# Altium schematic sheet ZHSD-USB-OTG.SchDoc
size A3; DocumentNumber: 10; SheetNumber: 10; SheetTotal: 17; Size: A3
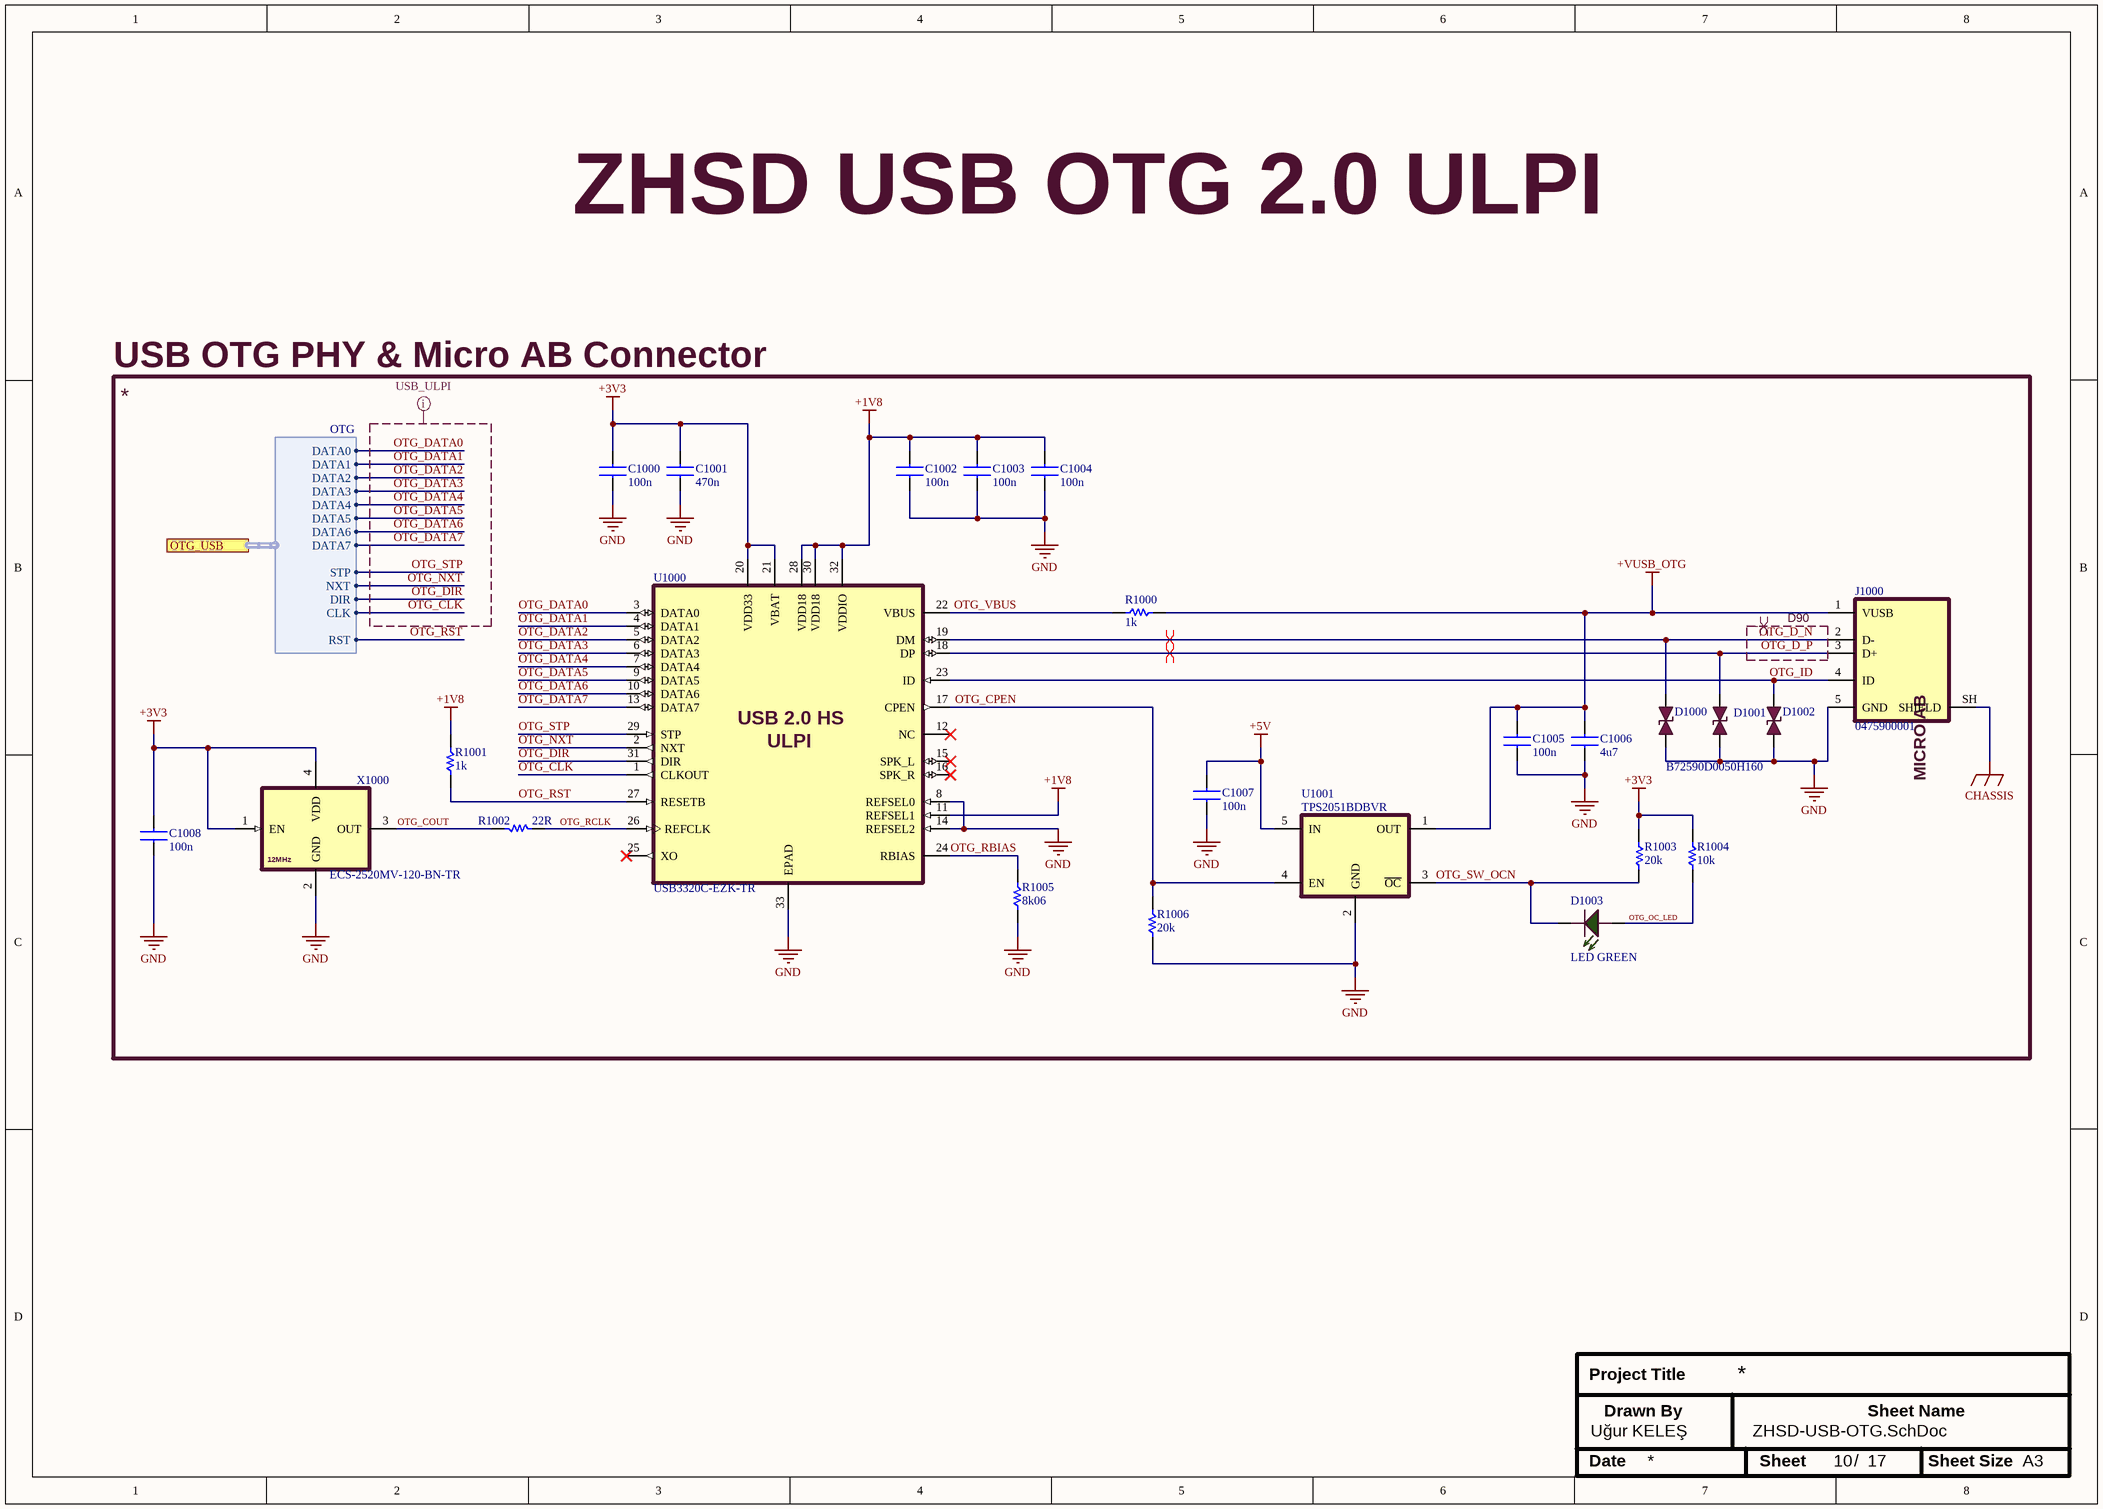
[diagram p0: ZHSD-USB-OTG.SchDoc]

## Parts
C1000  100n  [0603CAPC1608X09N]
C1001  470n  [0402CAPC1005X06N]
C1002  100n  [0603CAPC1608X09N]
C1003  100n  [0603CAPC1608X09N]
C1004  100n  [0603CAPC1608X09N]
C1005  100n  [0603CAPC1608X09N]
C1006  4u7  [0603CAPC1608X09N]
C1007  100n  [0603CAPC1608X09N]
C1008  100n  [0603CAPC1608X09N]
D1000  B72590D0050H160  [0402DIOC1005X06N]  (value not drawn)
D1001  B72590D0050H160  [0402DIOC1005X06N]  (value not drawn)
D1002  B72590D0050H160  [0402DIOC1005X06N]
D1003  LED GREEN  [0603_LED_1608N]
J1000  0475900001  [USB2.0 MICRO AB SMD]
R1000  1k  [0603RESC1608X05N]
R1001  1k  [0603RESC1608X05N]
R1002  22R  [0603RESC1608X05N]
R1003  20k  [0402RESC1005X04N]
R1004  10k  [0603RESC1608X05N]
R1005  8k06  [0402RESC1005X04N]
R1006  20k  [0402RESC1005X04N]
U1000  USB3320C-EZK-TR  [QFN50P500X500X100_HS-33N]
U1001  TPS2051BDBVR  [SOT95P280X125-5N]
X1000  ECS-2520MV-120-BN-TR  [XTAL_2520]

## Ports
OTG_USB (harness OTG, see ZHSD-Block[4000,3700], ZHSD-ZYNQ-MIO[8100,8300])

## Harnesses
OTG: DATA0, DATA1, DATA2, DATA3, DATA4, DATA5, DATA6, DATA7, STP, NXT, DIR, CLK, RST

## Nets
+1V8: C1002.2 C1003.2 C1004.2 R1001.2 U1000.11(REFSEL1) U1000.28(VDD18) U1000.30(VDD18) U1000.32(VDDIO)
+3V3: C1000.2 C1001.2 C1008.2 R1003.1 R1004.2 U1000.20(VDD33) U1000.21(VBAT) X1000.1(EN) X1000.4(VDD)
+5V: C1007.2 U1001.5(IN)
+VUSB_OTG: C1005.2 C1006.2 J1000.1(VUSB) R1000.2 U1001.1(OUT)
CHASSIS: J1000.SH(SHIELD)
GND: C1000.1 C1001.1 C1002.1 C1003.1 C1004.1 C1005.1 C1006.1 C1007.1 C1008.1 D1000.1 D1001.1 D1002.1 J1000.5(GND) R1005.1 R1006.1 U1000.8(REFSEL0) U1000.14(REFSEL2) U1000.33(EPAD) U1001.2(GND) X1000.2(GND)
OTG_CLK: U1000.1(CLKOUT) ; port OTG_USB.CLK
OTG_COUT: R1002.2 X1000.3(OUT)
OTG_CPEN: R1006.2 U1000.17(CPEN) U1001.4(EN)
OTG_D_N: D1000.2 J1000.2(D-) U1000.19(DM)
OTG_D_P: D1001.2 J1000.3(D+) U1000.18(DP)
OTG_DATA0: U1000.3(DATA0) ; port OTG_USB.DATA0
OTG_DATA1: U1000.4(DATA1) ; port OTG_USB.DATA1
OTG_DATA2: U1000.5(DATA2) ; port OTG_USB.DATA2
OTG_DATA3: U1000.6(DATA3) ; port OTG_USB.DATA3
OTG_DATA4: U1000.7(DATA4) ; port OTG_USB.DATA4
OTG_DATA5: U1000.9(DATA5) ; port OTG_USB.DATA5
OTG_DATA6: U1000.10(DATA6) ; port OTG_USB.DATA6
OTG_DATA7: U1000.13(DATA7) ; port OTG_USB.DATA7
OTG_DIR: U1000.31(DIR) ; port OTG_USB.DIR
OTG_ID: D1002.2 J1000.4(ID) U1000.23(ID)
OTG_NXT: U1000.2(NXT) ; port OTG_USB.NXT
OTG_OC_LED: D1003.1(A) R1004.1
OTG_RBIAS: R1005.2 U1000.24(RBIAS)
OTG_RCLK: R1002.1 U1000.26(REFCLK)
OTG_RST: R1001.1 U1000.27(RESETB) ; port OTG_USB.RST
OTG_STP: U1000.29(STP) ; port OTG_USB.STP
OTG_SW_OCN: D1003.2(C) R1003.2 U1001.3(~{OC})
OTG_VBUS: R1000.1 U1000.22(VBUS)

Not connected (* = marked no-connect by the designer): U1000 12(NC)* 15(SPK_L)* 16(SPK_R)* 25(XO)*

## Layout directives
differential pair: OTG_D_N, OTG_D_P
differential pair; differential pair class USB; rule Differential Pairs Routing [Pref Gap = 6.299mil    Min Gap  = 5mil    Max Gap  = 7.874milPref Width = 3.937mil    Min Width  = 3.937mil    Max Width  = 4.768mil]; Impedance: D90: OTG_D_N, OTG_D_P
net class USB_ULPI; rule Matched Net Lengths [Delay Tolerance = 10ps]: OTG_CLK, OTG_DATA0, OTG_DATA1, OTG_DATA2, OTG_DATA3, OTG_DATA4, OTG_DATA5, OTG_DATA6, OTG_DATA7, OTG_DIR, OTG_NXT, OTG_STP

## Notes on the sheet
- ZHSD USB OTG 2.0 ULPI
- USB OTG PHY & Micro AB Connector
- *
- Project Title
- Uğur KELEŞ
- Drawn By
- Sheet Name
- Date
- Sheet
- /
- Sheet Size
- A3
- (in symbol ECS-2520MV-120-BN-TR) 12MHz
- (in symbol USB3320C-EZK-TR) USB 2.0 HS; ULPI
- (in symbol USB-MICRO-AB) MICRO AB

## Library data of the parts
C1000 C1002-C1005 C1007 = GRM155R71C104KA88J: CAP CER 0.1UF 16V X7R 0402 (1005) ±10%; Manufacturer: Murata Electronics; Value: 0.1 µF; ComponentLink1Description: Datasheet; ComponentLink1URL: https://search.murata.co.jp/Ceramy/image/img/A01X/G101/ENG/GRM155R71C104KA88-01.pdf; MPN: GRM155R71C104KA88J; Package: 0402; Tolerance: ±10%; Voltage: 16V
C1001 = GRM155R60J474KE19D: CAP CER 0.47UF 6.3V X5R 0402(1005) ±10%; Manufacturer: Murata Electronics; Value: 0.47 µF; ComponentLink1Description: Datasheet; ComponentLink1URL: https://search.murata.co.jp/Ceramy/image/img/A01X/G101/ENG/GRM21BR71A475KE51-01.pdf; MPN: GRM155R60J474KE19D; Package: 0402; Tolerance: ±10%; Voltage: 6.3V
C1006 = CL10A475KP8NNNC: CAP CER 4.7UF 10V X5R 0603 (1608) ±10%; Manufacturer: Samsung Electro-Mechanics; Value: 4.7 µF; ComponentLink1Description: Datasheet; ComponentLink1URL: https://mm.digikey.com/Volume0/opasdata/d220001/medias/docus/609/CL10A475KP8NNNC_Spec.pdf; MPN: CL10A475KP8NNNC; Package: 0603; Tolerance: ±10%; Voltage: 10V
C1008 = C0603C104K5RACTU: CAP CER 0.1UF 50V X7R 0603 (1608) ±10%; Manufacturer: KEMET; Value: 0.1 µF; ComponentLink1Description: Datasheet; ComponentLink1URL: https://yageogroup.com/content/datasheet/asset/file/KEM_C1002_X7R_SMD; MPN: C0603C104K5RACTU; Package: 0603; Tolerance: ±10%; Voltage: 50V
D1000-D1002 = B72590D0050H160: Varistor 1 Circuit Surface Mount, MLCV 0402 (1005 Metric); Manufacturer: EPCOS - TDK Electronics; ComponentLink1Description: Datasheet; ComponentLink1URL: https://www.tdk-electronics.tdk.com/inf/75/ds/High_speed_series.pdf?ref_disty=digikey; MPN: B72590D0050H160; Package: 0402
D1003 = LTST-C191TGKT: LED GREEN CLEAR CHIP SMD; Manufacturer: Lite-On Inc.; ComponentLink1Description: Datasheet; ComponentLink1URL: https://optoelectronics.liteon.com/upload/download/DS22-2000-300/LTST-C191TGKT.PDF; MPN: LTST-C191TGKT; Package: 0603
J1000 = USB-MICRO-AB: CONN RCPT MICRO USB AB 5P SMD RA; Manufacturer: Molex; ComponentLink1Description: Datasheet; ComponentLink1URL: https://www.molex.com/content/dam/molex/molex-dot-com/products/automated/en-us/salesdrawingpdf/475/47590/475900001_sd.pdf?inline; MPN: 0475900001
R1000 R1001 = RC0603FR-071KL: RES 1K OHM 1% 1/10W 0603 (1608); Manufacturer: YAGEO; Value: 1 kOhms; Voltage: 75V; ComponentLink1Description: Datasheet; ComponentLink1URL: https://yageogroup.com/content/datasheet/asset/file/PYU-RC_GROUP_51_ROHS_L; MPN: RC0603FR-071KL; Tolerance: ±1%; Package: 0603
R1002 = RC0603FR-0722RL: RES 22 OHM 1% 1/10W 0603 (1608); Manufacturer: YAGEO; Value: 22 Ohms; Voltage: 75V; ComponentLink1Description: Datasheet; ComponentLink1URL: https://yageogroup.com/content/datasheet/asset/file/PYU-RC_GROUP_51_ROHS_L; MPN: RC0603FR-0722RL; Tolerance: ±1%; Package: 0603
R1003 R1006 = RC0402FR-0720KL: RES 20K OHM 1% 1/16W 0402 (1005); Manufacturer: YAGEO; Value: 20 kOhms; Voltage: 50V; ComponentLink1Description: Datasheet; ComponentLink1URL: https://yageogroup.com/content/datasheet/asset/file/PYU-RT_1-TO-0-01_ROHS_L; MPN: RC0402FR-0720KL; Tolerance: ±1%; Package: 0402
R1004 = RC0603FR-0710KL: RES 10K OHM 1% 1/10W 0603(1608); Manufacturer: YAGEO; Value: 10 kOhms; Voltage: 75V; ComponentLink1Description: Datasheet; ComponentLink1URL: https://yageogroup.com/content/datasheet/asset/file/PYU-RC_GROUP_51_ROHS_L; MPN: RC0603FR-0710KL; Tolerance: ±1%; Package: 0603
R1005 = RC0402FR-138K06L: RES 8.06K OHM 1% 1/16W 0402 (1005); Manufacturer: YAGEO; Value: 8.06 kOhms; Voltage: 50V; ComponentLink1Description: Datasheet; ComponentLink1URL: https://yageogroup.com/content/datasheet/asset/file/PYU-RT_1-TO-0-01_ROHS_L; MPN: RC0402FR-138K06L; Tolerance: ±1%; Package: 0402
U1000 = USB3320C-EZK-TR: Hi-Speed USB 2.0 ULPI Transceiver; Manufacturer: Microchip; MPN: USB3320C-EZK-TR; ComponentLink1Description: Datasheet; ComponentLink1URL: https://ww1.microchip.com/downloads/aemDocuments/documents/UNG/ProductDocuments/DataSheets/USB3320-Data-Sheet-DS00001792.pdf
U1001 = TPS2051BDBVR: Power Switch/Driver 1:1 N-Channel 500mA SOT-23-5; Manufacturer: Texas Instruments; ComponentLink1Description: Datasheet; ComponentLink1URL: https://www.ti.com/lit/ds/symlink/tps2051b.pdf?ts=1769451796682&ref_url=https%253A%252F%252Fwww.ti.com%252Fproduct%252FTPS2051B; MPN: TPS2051BDBVR
X1000 = ECS-2520MV-120-BN-TR: XTAL OSC XO 12.0000MHZ CMOS SMD; Manufacturer: ECS Inc.; ComponentLink1Description: Datasheet; ComponentLink1URL: https://ecsxtal.com/store/pdf/ECS-2520MV.pdf; MPN: ECS-2520MV-120-BN-TR